# EAGLE design dso_v3b (EAGLE 6.4)
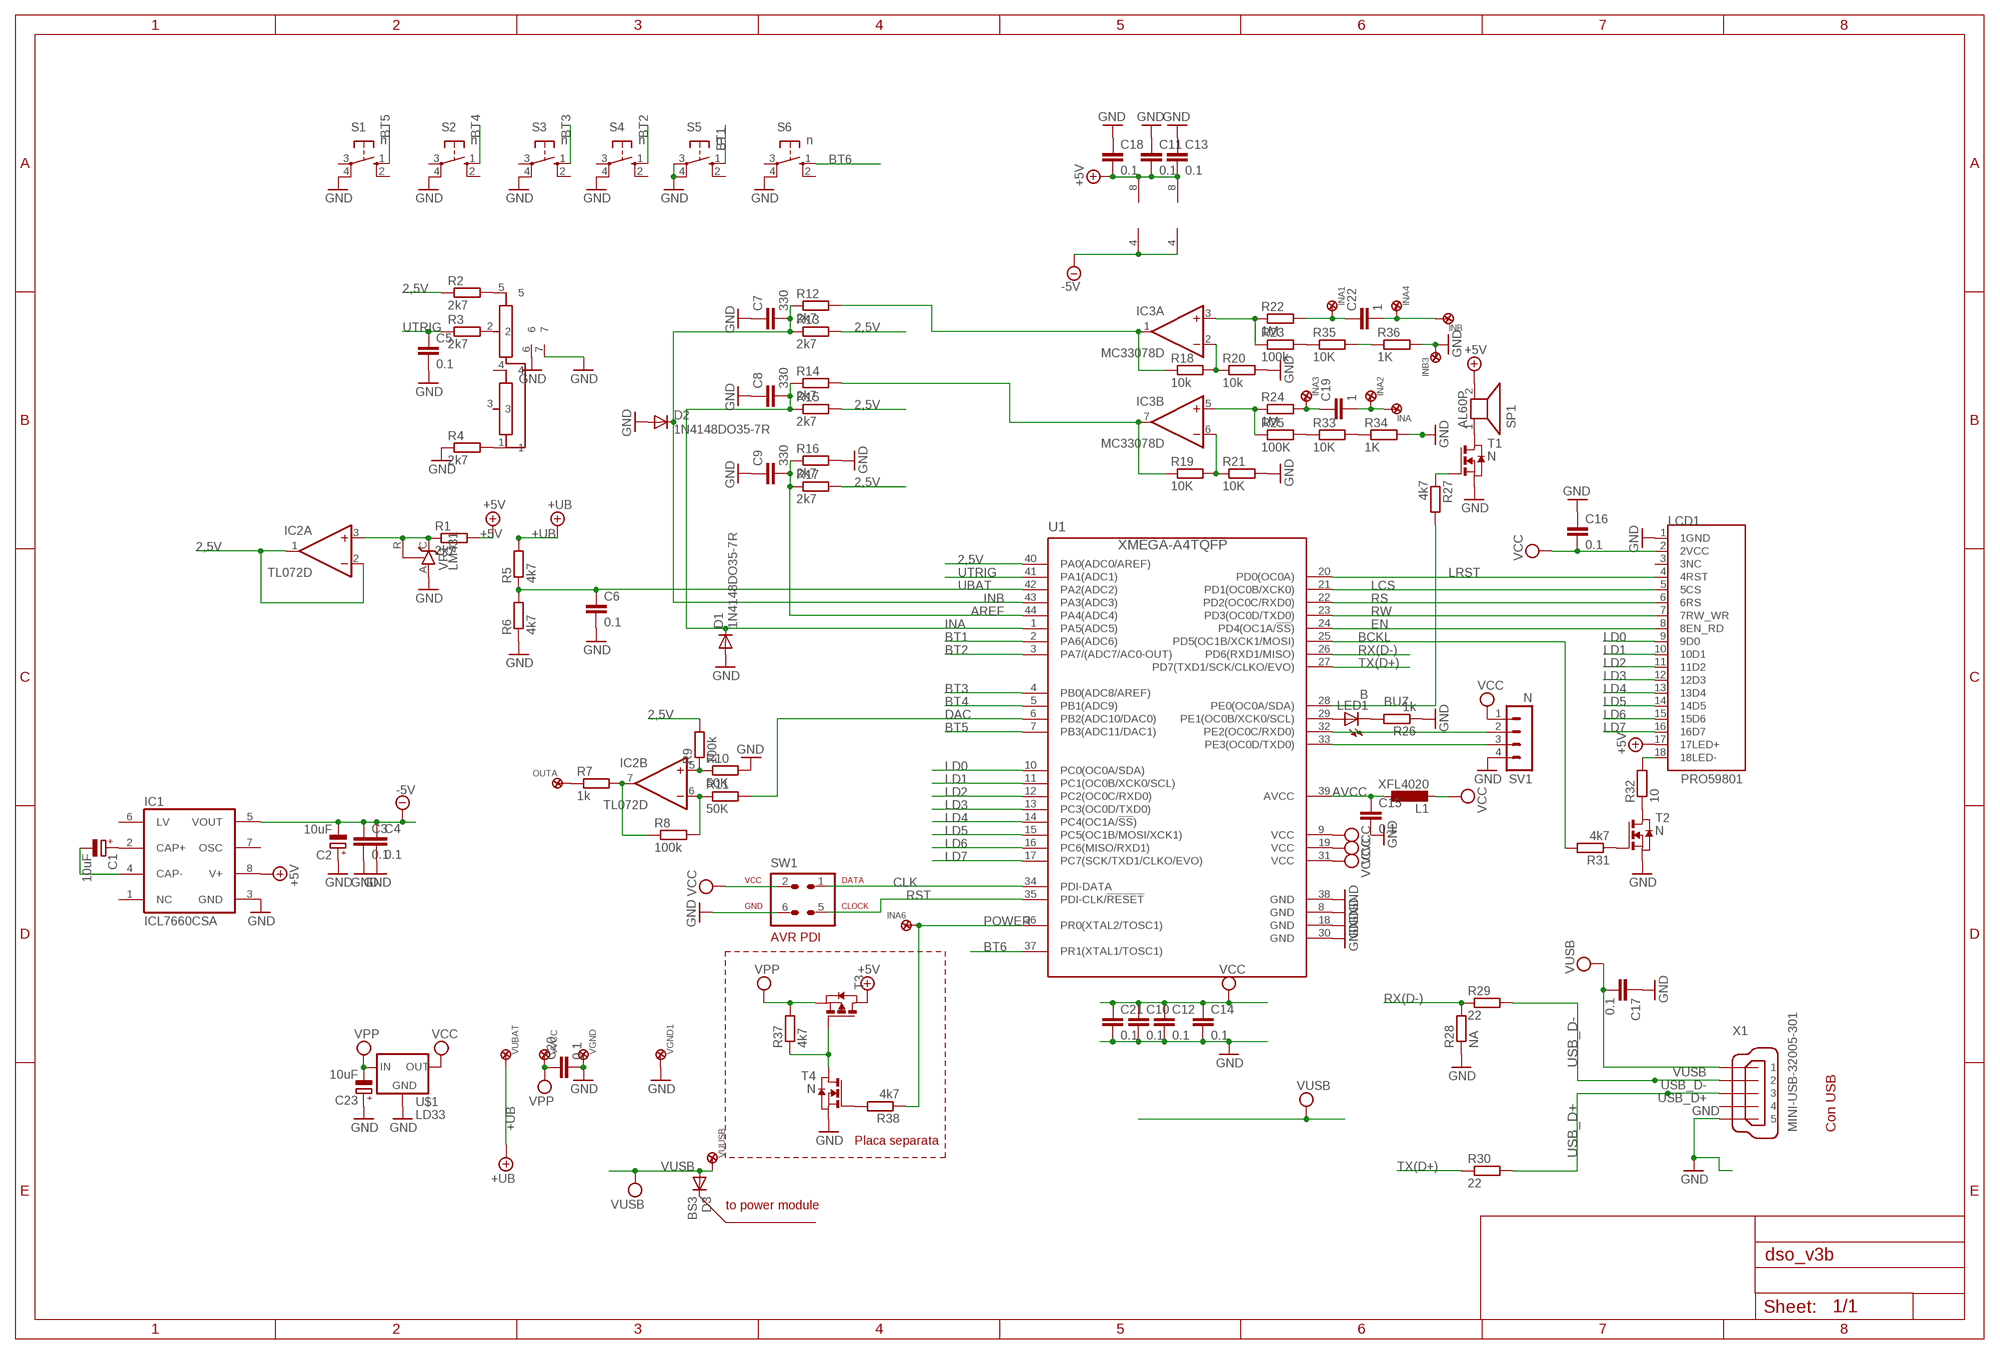
[diagram p0: schematic, sheet 1]

## Parts
C1  10uF  CPOL-EUCT3528  [CT3528]
C2  10uF  CPOL-EUCT3528  [CT3528]
C3  0.1  C-EUC0603  [C0603]
C4  0.1  C-EUC0603  [C0603]
C5  0.1  C-EUC0603  [C0603]
C6  0.1  C-EUC0603  [C0603]
C7  330  C-EU025-024X044  [C025-024X044]
C8  330  C-EU025-024X044  [C025-024X044]
C9  330  C-EU025-024X044  [C025-024X044]
C10  0.1  C-EUC0603  [C0603]
C11  0.1  C-EUC0603  [C0603]
C12  0.1  C-EUC0603  [C0603]
C13  0.1  C-EUSPEC  [SMD_SPECIAL]
C14  0.1  C-EUC0603  [C0603]
C15  0.1  C-EUC0603  [C0603]
C16  0.1  C-EUC0603  [C0603]
C17  0.1  C-EUC1206  [C1206]
C18  0.1  C-EUC0603  [C0603]
C19  1  C-EUC0603  [C0603]
C20  0.1  C-EUC0805  [C0805]
C21  0.1  C-EUC0805  [C0805]
C22  1  C-EUC0603  [C0603]
C23  10uF  CPOL-EUCT3528  [CT3528]
D1  1N4148DO35-7R  [DO35-7R]
D2  1N4148DO35-7R  [DO35-7R]
D3  BS3  1N4148DO35-7R  [DO35-7R]
IC1  ICL7660CSA  [SO08]
IC2  TL072D  [SO08]
IC3  MC33078D  [SO08]
INA  PADR1  [LP1]
INA1  PADR  [LP]
INA2  PADR  [LP]
INA3  PADR  [LP]
INA4  PADR  [LP]
INA6  PADR1  [LP1]
INB  PADR1  [LP1]
INB3  PADR1  [LP1]
L1  XFL4020  [XFL4020]
LCD1  PRO59801  PRO59801L  [PRO59801L]
LED1  B  LED3MM  [LED3MM]
OUTA  PADR1  [LP1]
P1  POT5P  [POT5P]
R1  2k7  R-EU_0204/7  [0204/7]
R2  2k7  R-EU_R0603  [R0603]
R3  2k7  R-EU_R0603  [R0603]
R4  2k7  R-EU_SPEC  [SMD_SPECIAL]
R5  4k7  R-EU_R0603  [R0603]
R6  4k7  R-EU_R0603  [R0603]
R7  1k  R-EU_R0603  [R0603]
R8  100k  R-EU_R0805  [R0805]
R9  100k  R-EU_R0805  [R0805]
R10  50K  R-EU_R0805  [R0805]
R11  50K  R-EU_SPEC  [SMD_SPECIAL]
R12  2k7  R-EU_SPEC  [SMD_SPECIAL]
R13  2k7  R-EU_R0603  [R0603]
R14  2k7  R-EU_SPEC  [SMD_SPECIAL]
R15  2k7  R-EU_R0603  [R0603]
R16  2k7  R-EU_SPEC  [SMD_SPECIAL]
R17  2k7  R-EU_SPEC  [SMD_SPECIAL]
R18  10k  R-EU_R0805  [R0805]
R19  10K  R-EU_R0805  [R0805]
R20  10k  R-EU_R0805  [R0805]
R21  10K  R-EU_R0805  [R0805]
R22  1M  R-EU_R0805  [R0805]
R23  100k  R-EU_R0805  [R0805]
R24  1M  R-EU_R0805  [R0805]
R25  100K  R-EU_R0603  [R0603]
R26  1k  R-EU_R0603  [R0603]
R27  4k7  R-EU_0204/7  [0204/7]
R28  NA  R-EU_R0603  [R0603]
R29  22  R-EU_R0603  [R0603]
R30  22  R-EU_R0603  [R0603]
R31  4k7  R-EU_R0603  [R0603]
R32  10  R-EU_SPEC  [SMD_SPECIAL]
R33  10K  R-EU_R0805  [R0805]
R34  1K  R-EU_R0603  [R0603]
R35  10K  R-EU_R0805  [R0805]
R36  1K  R-EU_R0603  [R0603]
R37  4k7  R-EU_R0603  [R0603]
R38  4k7  R-EU_R0603  [R0603]
S1  n  10-XX  [B3F-10XX]
S2  n  10-XX  [B3F-10XX]
S3  n  10-XX  [B3F-10XX]
S4  n  10-XX  [B3F-10XX]
S5  n  10-XX  [B3F-10XX]
S6  n  10-XX  [B3F-10XX]
SP1  AL60P  [AL60P]
SV1  N  MA04-1R  [MA04-1R]
SW1  AVR-PDIS  [AVR-ISP-6S]
T1  N  NMOSSOT23  [SOT-23]
T2  N  NMOSSOT23  [SOT-23]
T3  PMOSSOT23  [SOT-23]
T4  N  NMOSSOT23  [SOT-23]
U1  XMEGA-A4TQFP  [TQFP44]
U$1  LD33  [SOT223]
VGND  PADR1  [LP1]
VGND1  PADR1  [LP1]
VR1  LM431  TL431CLP  [TO92-CLP]
VUBAT  PADR1  [LP1]
VUUSB  PADR1  [LP1]
VVCC  PADR1  [LP1]
X1  MINI-USB-32005-301  [32005-301]

## Nets
2,5V: IC2.1(A:OUT) IC2.2(A:-IN) R2.1 R9.2 R13.2 R15.2 R17.4 U1.40(PA0(ADC0/AREF))
+5V: C11.2 C13.4 C18.2 IC1.8(V+) IC2.8(P:V+) IC3.8(P:V+) LCD1.17(17LED+) R1.2 SP1.2 T3.1(D)
+UB: R5.2 VUBAT.P$1
-5V: C2.- C3.1 C4.1 IC1.5(VOUT) IC2.4(P:V-) IC3.4(P:V-)
AREF: C9.2 R16.3 R17.3 U1.44(PA4(ADC4))
AVCC: C15.1 L1.P$1 U1.39(AVCC)
BCKL: R31.2 U1.25(PD5(OC1B/XCK1/MOSI))
BT1: S5.1(S) U1.2(PA6(ADC6))
BT2: S4.1(S) U1.3(PA7/(ADC7/AC0-OUT))
BT3: S3.1(S) U1.4(PB0(ADC8/AREF))
BT4: S2.1(S) U1.5(PB1(ADC9))
BT5: S1.1(S) U1.7(PB3(ADC11/DAC1))
BT6: S6.1(S) U1.37(PR1(XTAL1/TOSC1))
BUZ: R27.2 U1.28(PE0(OC0A/SDA))
CLK: SW1.1 U1.34(PDI-DATA)
DAC: R11.4 U1.6(PB2(ADC10/DAC0))
EN: LCD1.8(8EN_RD) U1.24(PD4(OC1A/!SS!))
GND: C2.+ C3.2 C4.2 C5.2 C6.2 C7.1 C8.1 C9.1 C10.2 C11.1 C12.2 C13.3 C14.2 C15.2 C16.1 C17.1 C18.1 C20.2 C21.2 C23.+ D1.A D2.A IC1.3(GND) INB3.P$1 LCD1.1(1GND) P1.6 P1.7 R4.3 R6.1 R10.2 R16.4 R20.2 R21.2 R26.1 R28.1 R34.2 R36.2 S1.4(P1) S2.4(P1) S3.4(P1) S4.4(P1) S5.3(P) S5.4(P1) S6.4(P1) SV1.4 SW1.6 T1.2(S) T2.2(S) T4.2(S) U1.8(GND) U1.18(GND) U1.30(GND) U1.38(GND) U$1.1(GND) VGND1.P$1 VGND.P$1 VR1.A X1.5
INA: C8.2 D1.C R14.3 R15.1 U1.1(PA5(ADC5))
INB: C7.2 D2.C R12.3 R13.1 U1.43(PA3(ADC3))
LCS: LCD1.5(5CS) U1.21(PD1(OC0B/XCK0))
LD0: LCD1.9(9D0) U1.10(PC0(OC0A/SDA))
LD1: LCD1.10(10D1) U1.11(PC1(OC0B/XCK0/SCL))
LD2: LCD1.11(11D2) U1.12(PC2(OC0C/RXD0))
LD3: LCD1.12(12D3) U1.13(PC3(OC0D/TXD0))
LD4: LCD1.13(13D4) U1.14(PC4(OC1A/!SS!))
LD5: LCD1.14(14D5) U1.15(PC5(OC1B/MOSI/XCK1))
LD6: LCD1.15(15D6) U1.16(PC6(MISO/RXD1))
LD7: LCD1.16(16D7) U1.17(PC7(SCK/TXD1/CLKO/EVO))
LRST: LCD1.4(4RST) U1.20(PD0(OC0A))
N$1: C1.+ IC1.2(CAP+)
N$2: C1.- IC1.4(CAP-)
N$3: R37.1 T3.3(G) T4.1(D)
N$4: IC2.3(A:+IN) R1.1 VR1.C VR1.R
N$5: R38.2 T4.3(G)
N$6: LED1.A U1.29(PE1(OC0B/XCK0/SCL))
N$7: SV1.2 U1.32(PE2(OC0C/RXD0))
N$8: SV1.3 U1.33(PE3(OC0D/TXD0))
N$9: R27.1 T1.3(G)
N$10: LCD1.18(18LED-) R32.4
N$11: R32.3 T2.1(D)
N$12: R31.1 T2.3(G)
N$13: R33.2 R34.1
N$14: P1.1 R4.4
N$15: P1.5 R2.2
N$16: IC3.1(A:OUT) R12.4 R18.1
N$17: IC3.7(B:OUT) R14.4 R19.1
N$18: P1.2 R3.2
N$19: IC3.3(A:+IN) R22.1 R23.1
N$20: IC3.2(A:-IN) R18.2 R20.1
N$21: IC3.5(B:+IN) R24.1 R25.1
N$22: IC3.6(B:-IN) R19.2 R21.1
N$23: C22.2 INA4.P$1 INB.P$1
N$24: C19.2 INA2.P$1 INA.P$1
N$25: IC2.5(B:+IN) R9.1 R10.1
N$26: IC2.6(B:-IN) R8.2 R11.3
N$27: IC2.7(B:OUT) R7.2 R8.1
N$28: OUTA.P$1 R7.1
N$30: SP1.1 T1.1(D)
N$31: LED1.K(C) R26.2
N$36: C19.1 INA3.P$1 R24.2
N$37: R25.2 R33.1
N$38: R23.2 R35.1
N$41: R35.2 R36.1
N$42: C22.1 INA1.P$1 R22.2
POWER: INA6.P$1 R38.1 U1.36(PR0(XTAL2/TOSC1))
RS: LCD1.6(6RS) U1.22(PD2(OC0C/RXD0))
RST: SW1.5 U1.35(PDI-CLK/!RESET)
RW: LCD1.7(7RW_WR) U1.23(PD3(OC0D/TXD0))
RX(D-): R28.2 R29.1 U1.26(PD6(RXD1/MISO))
TX(D+): R30.1 U1.27(PD7(TXD1/SCK/CLKO/EVO))
UBAT: C6.1 R5.1 R6.2 U1.42(PA2(ADC2))
USB_D+: R30.2 X1.3
USB_D-: R29.2 X1.2
UTRIG: C5.1 R3.1 U1.41(PA1(ADC1))
VCC: C10.1 C12.1 C14.1 C16.2 C21.1 L1.P$2 LCD1.2(2VCC) SV1.1 SW1.2 U1.9(VCC) U1.19(VCC) U1.31(VCC) U$1.2(OUT) U$1.4(OUT)
VPP: C20.1 C23.- R37.2 T3.2(S) U$1.3(IN) VVCC.P$1
VUSB: C17.2 D3.A VUUSB.P$1 X1.1
Unconnected: D3.C IC1.1(NC) IC1.6(LV) IC1.7(OSC) LCD1.3(3NC) P1.3 P1.4 S1.2(S1) S1.3(P) S2.2(S1) S2.3(P) S3.2(S1) S3.3(P) S4.2(S1) S4.3(P) S5.2(S1) S6.2(S1) S6.3(P) X1.4

## Notes on the sheet
- Con USB
- Placa separata
- to power module

## Library data of the parts
C1 C2 C23 = 000a:CPOL-EU: POLARIZED CAPACITOR, European symbol
C3-C16 C18-C22 = 000a:C-EU: CAPACITOR, European symbol
C17 = rcl:C-EU: CAPACITOR, European symbol
D1-D3 = 000t:1N4148: DIODE high speed (Philips)
IC1 = maxim:ICL7660CSA: VOLTAGE CONVERTER; MF: MAXIM; MPN: ICL7660CSA; OC_FARNELL: 9724710; OC_NEWARK: 34C3732
IC2 = linear:TL072: OP AMP
IC3 = linear:MC33078: OP AMP
INA INA1-INA4 INA6 INB INB3 OUTA VGND VGND1 VUBAT VUUSB VVCC = 0000:PAD
L1 = 000a:XFL4020
LCD1 = 0000:PRO59801
LED1 = 000o:LED: LED OSRAM: - CHIPLED LG R971, LG N971, LY N971, LG Q971, LY Q971, LO R971, LY R971 LH N974, LH R974 LS Q976, LO Q976, LY Q976 LO Q996 - Hyper CHIPLED LW Q18S LB Q993, LB Q99A, LB R99A - SideLED LS A670, LO A670, LY A670, LG A670, LP A670 LB A673, LV A673, LT A673, LW A673 LH A674 LY A675 LS A676, LA A676, LO A676, LY A676, LW A676 LS A679, LY A679, LG A679 - Hyper Micro SIDELED® LS Y876, LA Y876, LO Y876, LY Y876 LT Y87S - SmartLED LW L88C, LW L88S LB L89C, LB L89S, LG L890 LS L89K, LO L89K, LY L89K LS L896, LA L896, LO L896, LY L896 - TOPLED LS T670, LO T670, LY T670, LG T670, LP T670 LSG T670, LSP T670, LSY T670, LOP T670, LYG T670 LG T671, LOG T671, LSG T671 LB T673, LV T673, LT T673, LW T673 LH T674 LS T676, LA T676, LO T676, LY T676, LB T676, LH T676, LSB T676, LW T676 LB T67C, LV T67C, LT T67C, LS T67K, LO T67K, LY T67K, LW E67C LS E67B, LA E67B, LO E67B, LY E67B, LB E67C, LV E67C, LT E67C LW T67C LS T679, LY T679, LG T679 LS T770, LO T770, LY T770, LG T770, LP T770 LB T773, LV T773, LT T773, LW T773 LH T774 LS E675, LA E675, LY E675, LS T675 LS T776, LA T776, LO T776, LY T776, LB T776 LHGB T686 LT T68C, LB T68C - Hyper Mini TOPLED® LB M676 - Mini TOPLED Santana® LG M470 LS M47K, LO M47K, LY M47K Source: http://www.osram.convergy.de LUXEON: - LUMILED® LXK2-PW12-R00, LXK2-PW12-S00, LXK2-PW14-U00, LXK2-PW14-V00 LXK2-PM12-R00, LXK2-PM12-S00, LXK2-PM14-U00 LXK2-PE12-Q00, LXK2-PE12-R00, LXK2-PE12-S00, LXK2-PE14-T00, LXK2-PE14-U00 LXK2-PB12-K00, LXK2-PB12-L00, LXK2-PB12-M00, LXK2-PB14-N00, LXK2-PB14-P00, LXK2-PB14-Q00 LXK2-PR12-L00, LXK2-PR12-M00, LXK2-PR14-Q00, LXK2-PR14-R00 LXK2-PD12-Q00, LXK2-PD12-R00, LXK2-PD12-S00 LXK2-PH12-R00, LXK2-PH12-S00 LXK2-PL12-P00, LXK2-PL12-Q00, LXK2-PL12-R00 Source: www.luxeon.com KINGBRIGHT: KA-3528ASYC Source: www.kingbright.com
P1 = 000a:POT5P
R1-R38 = 000a:R-EU_: RESISTOR, European symbol
S1-S6 = 0000:10-XX: OMRON SWITCH; MPN: B3F-1000; OC_FARNELL: 176432; OC_NEWARK: 36M3542
SP1 = buzzer:AL60P: SPEAKER Source: Buerklin; OC_FARNELL: unknown; OC_NEWARK: unknown
SV1 = 0000:MA04-1: PIN HEADER
SW1 = avr-7:AVR-PDI: AVR PDI programming interface connector
T1 T2 T4 = zetex:NMOSSOT23: MOS FET; OC_FARNELL: unknown; OC_NEWARK: unknown
T3 = zetex:PMOSSOT23: MOS FET; OC_FARNELL: unknown; OC_NEWARK: unknown
U1 = avr-7:XMEGA-A4: Atmel XMega A4 series processor
U$1 = 000t:LD33
VR1 = v-reg:TL431CLP: VOLTAGE REGULATOR
X1 = con-cypressindustries:MINI-USB-: MINI USB-B Conector Source: www.cypressindustries.com; OC_FARNELL: unknown; OC_NEWARK: unknown

## Board
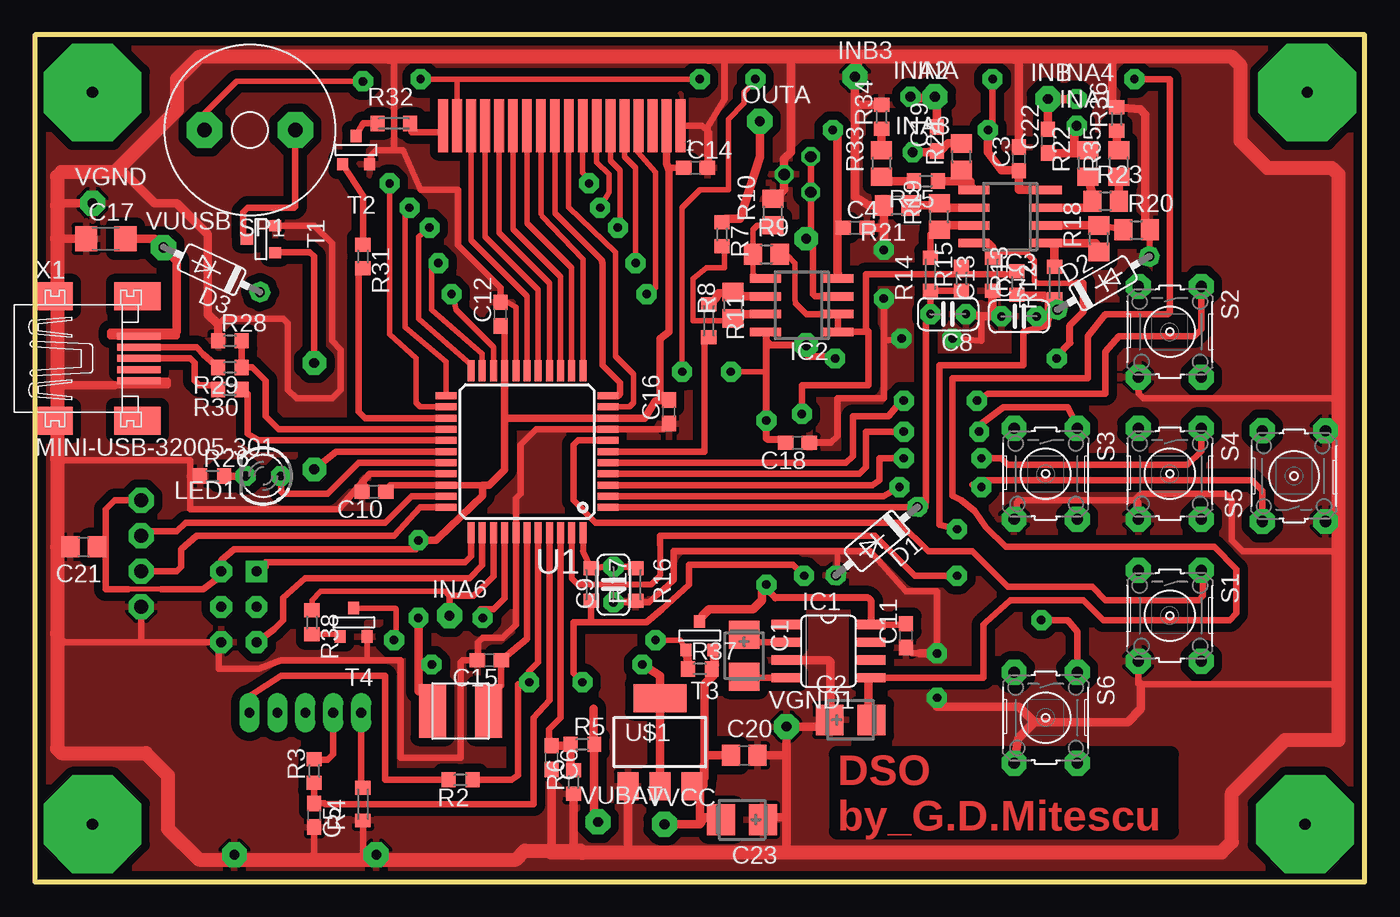
[diagram p1: board, top side]
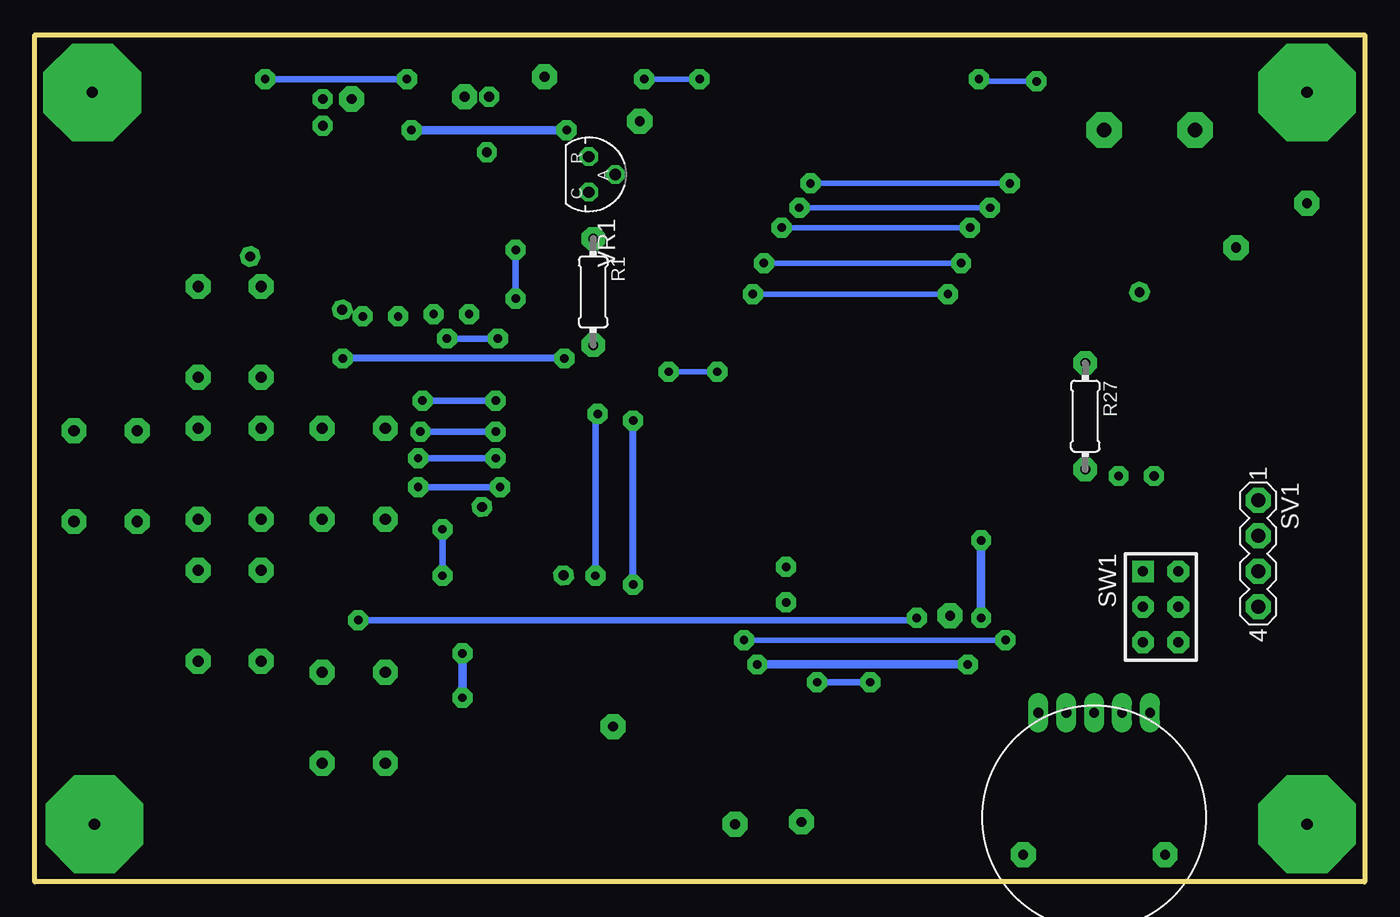
[diagram p2: board, bottom side, seen from below]

Size 95.23 x 60.63 mm. Coordinates in mm from the lower left corner, seen from the top.
Outline: 0,0 95.23,0 95.23,60.63 0,60.63 0,0
Copper layers (1+2+16): Top 0.035mm / dielectric 1.5mm / Route2 0.035mm / dielectric 0.15mm / Bottom 0.035mm
Design rules "default *": minimum track width 10mil, minimum drill 10mil, track to track 8mil, track to pad 8mil, pad to pad 8mil, via to via 8mil, smd to smd 8mil, copper to edge 24mil, drill to drill 8mil, minimum pad ring 10mil, minimum via ring 8mil, stop-mask expansion 4mil, vias tented up to drill 0mil, thermal gap 10mil

### Footprints (pad centres in the part's own frame; a part is rotated, then mirrored left to right if it is on the bottom)
CT3528 = smd 2 x 2.2: + -1.5,0; - 1.5,0
C0603 = smd 1.1 x 1: 1 -0.85,0; 2 0.85,0
C025-024X044 = drill 0.6 pad 1.422 octagon: 1 -1.27,0; 2 1.27,0
SMD_SPECIAL = smd 1 x 1.1: 3 -1.167,0; 4 1.167,0
C1206 = smd 1.6 x 1.8: 1 -1.4,0; 2 1.4,0
C0805 = smd 1.3 x 1.5: 1 -0.95,0; 2 0.95,0
DO35-7R = drill 0.7 pad 1.422 octagon: A 3.81,0; C -3.81,0
SO08 = smd 0.66 x 2.032: 1 -1.905,-3.073; 2 -0.635,-3.073; 3 0.635,-3.073; 4 1.905,-3.073; 5 1.905,3.073; 6 0.635,3.073; 7 -0.635,3.073; 8 -1.905,3.073
SO08' = smd 0.6 x 2.2: 1 -1.905,-2.6; 2 -0.635,-2.6; 3 0.635,-2.6; 4 1.905,-2.6; 5 1.905,2.6; 6 0.635,2.6; 7 -0.635,2.6; 8 -1.905,2.6
LP1 = drill 0.7 pad 1.8 octagon: P$1 0,0
LP = drill 0.7 pad 1.422 octagon: P$1 0,0
XFL4020 = smd 3.81 x 1.93: P$1 0,2; P$2 0,-2
PRO59801L = smd 0.7 x 3.8: 1 -8.77,0; 2 -7.77,0; 3 -6.77,0; 4 -5.77,0; 5 -4.77,0; 6 -3.77,0; 7 -2.77,0; 8 -1.77,0; 9 -0.77,0; 10 0.23,0; 11 1.23,0; 12 2.23,0; 13 3.23,0; 14 4.23,0; 15 5.23,0; 16 6.23,0; 17 7.23,0; 18 8.23,0
LED3MM = drill 0.6 pad 1.422 octagon: A -1.27,0 | drill 0.7 pad 1.422 octagon: K 1.27,0
POT5P = drill 0.7 pad 1.422 long: 1 -4,7.5; 2 -2,7.5; 3 0,7.5; 4 2,7.5; 5 4,7.5 | drill 0.7 pad 1.778 octagon: 6 -5.08,-2.66; 7 5.08,-2.66
0204/7 = drill 0.7 pad 1.676 octagon: 1 -3.81,0; 2 3.81,0
R0603 = smd 1 x 1.1: 1 -0.85,0; 2 0.85,0
R0805 = smd 1.3 x 1.5: 1 -0.95,0; 2 0.95,0
B3F-10XX = drill 0.8 pad 1.778 octagon: 1 -3.251,2.261; 2 3.251,2.261; 3 -3.251,-2.261; 4 3.251,-2.261
AL60P = drill 1.016 pad 2.54 octagon: 1 -3.251,0; 2 3.251,0
MA04-1R = drill 1.016 pad 1.778 octagon: 1 -3.81,0; 2 -1.27,0; 3 1.27,0; 4 3.81,0
AVR-ISP-6S = drill 0.7 pad 1.55 square: 1 -2.54,-1.27 | drill 0.7 pad 1.55 octagon: 2 -2.54,1.27; 3 0,-1.27; 4 0,1.27; 5 2.54,-1.27; 6 2.54,1.27
SOT-23 = smd 0.787 x 0.889: 1 0.025,-1.016; 2 -0.94,1.016; 3 0.991,1.016
TQFP44 = smd 1.5 x 0.5: 1 -5.8,4; 2 -5.8,3.2; 3 -5.8,2.4; 4 -5.8,1.6; 5 -5.8,0.8; 6 -5.8,0; 7 -5.8,-0.8; 8 -5.8,-1.6; 9 -5.8,-2.4; 10 -5.8,-3.2; 11 -5.8,-4; 23 5.8,-4; 24 5.8,-3.2; 25 5.8,-2.4; 26 5.8,-1.6; 27 5.8,-0.8; 28 5.8,0; 29 5.8,0.8; 30 5.8,1.6; 31 5.8,2.4; 32 5.8,3.2; 33 5.8,4 | smd 0.5 x 1.5: 12 -4,-5.8; 13 -3.2,-5.8; 14 -2.4,-5.8; 15 -1.6,-5.8; 16 -0.8,-5.8; 17 0,-5.8; 18 0.8,-5.8; 19 1.6,-5.8; 20 2.4,-5.8; 21 3.2,-5.8; 22 4,-5.8; 34 4,5.8; 35 3.2,5.8; 36 2.4,5.8; 37 1.6,5.8; 38 0.8,5.8; 39 0,5.8; 40 -0.8,5.8; 41 -1.6,5.8; 42 -2.4,5.8; 43 -3.2,5.8; 44 -4,5.8
SOT223 = smd 1.5 x 2: 1 -2.3,-3.15; 2 0,-3.15; 3 2.3,-3.15 | smd 3.8 x 2: 4 0,3.15
TO92-CLP = drill 0.813 octagon: A 0,1.905; C 1.27,0; R -1.27,0
32005-301 = smd 3.1 x 0.5: 1 3,1.6; 2 3,0.8; 3 3,0; 4 3,-0.8; 5 3,-1.6 | smd 2.5 x 2: M1 -3,-4.45; M2 -3,4.45 | smd 3.3 x 2: M3 2.9,4.45; M4 2.9,-4.45

### Placement (x,y rotation side)
C1  50.8,16.19 270 top
C2  58.42,11.59 0 top
C3  70.48,51.75 90 top
C4  58.74,46.83 0 top
C5  20,4.76 270 top
C6  36.99,8.89 270 top
C7  70.48,40.48 0 top
C8  65.41,40.64 180 top
C9  41.43,21.27 90 top
C10  24.29,27.94 180 top
C11  62.39,17.62 90 top
C12  33.34,40.64 90 top
C13  68.58,43.5 90 top
C14  47.31,51.12 0 top
C15  32.54,15.88 180 top
C16  45.4,33.66 90 top
C17  5.08,46.04 0 top
C18  54.61,31.43 180 top
C19  64.61,53.18 90 top
C20  50.8,9.05 0 top
C21  3.49,23.97 180 top
C22  72.55,53.02 90 top
C23  50.64,4.45 180 top
D1  60.29,24.39 220 top
D2  76.52,42.86 30 top
D3  12.67,43.82 155 top
IC1  56.83,16.51 270 top
IC2  TL072D  [SO08']  54.93,41.27 90 top
IC3  MC33078D  [SO08']  69.85,47.62 90 top
INA  64.45,56.2 0 top
INA1  74.61,54.13 0 top
INA2  62.71,56.2 0 top
INA3  62.87,52.23 0 top
INA4  74.61,56.04 0 top
INA6  29.69,19.05 0 top
INB  72.55,56.04 0 top
INB3  58.74,57.63 0 top
L1  30.48,12.22 270 top
LCD1  37.46,54.13 180 top
LED1  16.35,29.05 180 top
OUTA  51.91,54.45 0 top
P1  19.37,4.6 0 bottom
R1  55.24,42.23 270 bottom
R2  30.48,7.3 180 top
R3  20,7.94 90 top
R4  23.49,5.56 90 top
R5  39.21,9.84 0 top
R6  38.58,7.14 90 top
R7  49.21,46.35 270 top
R8  50.01,41.27 90 top
R9  52.39,44.93 0 top
R10  52.86,47.94 90 top
R11  48.26,40.16 270 top
R12  73.03,42.86 90 top
R13  70.33,42.86 90 top
R14  64.14,43.5 90 top
R15  66.36,43.18 90 top
R16  43.02,21.27 270 top
R17  39.85,21.27 270 top
R18  76.2,46.04 90 top
R19  64.77,47.62 90 top
R20  78.9,46.67 0 top
R21  61.75,48.42 180 top
R22  75.41,51.44 90 top
R23  76.68,48.74 0 top
R24  66.36,51.91 90 top
R25  63.82,50.16 180 top
R26  12.7,29.05 0 top
R27  20,33.34 270 bottom
R28  13.97,38.73 0 top
R29  13.97,36.83 180 top
R30  13.97,35.24 180 top
R31  23.49,44.77 270 top
R32  25.72,54.29 0 top
R33  60.64,51.44 90 top
R34  60.64,54.77 90 top
R35  77.63,51.44 90 top
R36  77.47,54.61 90 top
R37  47.62,15.24 0 top
R38  19.84,18.57 270 top
S1  81.28,19.05 270 top
S2  81.28,39.37 270 top
S3  72.39,29.21 270 top
S4  81.28,29.21 270 top
S5  90.17,29.05 90 top
S6  72.39,11.75 270 top
SP1  15.4,53.82 180 top
SV1  7.62,23.5 270 bottom
SW1  14.61,19.68 270 bottom
T1  16.19,46.04 270 top
T2  23.02,52.39 180 top
T3  47.62,17.62 180 top
T4  22.86,18.57 180 top
U1  35.24,30.8 180 top
U$1  44.77,10 0 top
VGND  4.13,48.58 0 top
VGND1  53.82,11.11 0 top
VR1  55.56,50.64 270 bottom
VUBAT  40.32,4.29 0 top
VUUSB  9.21,45.4 0 top
VVCC  45.09,4.13 0 top
X1  4.45,37.47 0 top

### Tracks (layer width: path | path; a pad name or v marks a point on that pad's centre or on a via)
2,5V  (via drill 0.6 pad 1.42)
  Top 0.406: R9.2 53.82,44.93 54.45,44.29 54.45,41.64 54.51,41.38
  Top 0.45: R13.2 70.38,43.71 70.17,43.5 66.36,43.5 | R15.2 66.46,44.13 66.46,43.6 66.36,43.5 | U1.40 36.04,15.72 35.72,15.4 35.41,15.07 v35.41,14.29 | v35.41,14.29 v35.4,14.29 | v35.41,14.29 34.61,14.13 34.61,7.63 34.13,7.3 R2.1 | IC2.1 IC2.2 55.24,40.64 54.51,41.38 | IC2.1 59.53,39.37 59.53,43.5 66.36,43.5 | R17.4 39.85,18.57 | 39.85,18.57 43.81,18.57 44.93,19.53 46.83,21.27 46.83,22.7 54.29,22.7 v55.09,21.91 | v54.93,33.5 54.93,35.56 59.69,35.56 59.69,39.43 IC2.1 | 39.85,18.57 38.58,18.57 38.58,14.92 v39.21,14.29
  Bottom 0.45: v39.21,14.29 v35.4,14.29 | v55.09,21.91 55.09,33.34 v54.93,33.5
+5V  (via drill 0.6 pad 1.42)
  Top 0.406: 74.61,42.86 71.76,42.86 71.6,43.02 71.6,44.45 70.96,45.09 68.74,45.09 68.58,45.24 | SP1.2 12.15,55.01 14.45,57.31 v23.49,57.31 | v27.62,57.47 30.32,57.47 | 30.32,57.47 v47.63,57.47 | v51.59,57.47 51.59,57.31 50.8,56.52 50.8,55.72 49.69,54.61 49.69,49.53 47.63,49.53 46.35,48.26 v46.35,36.51 | LCD1.17 30.24,57.38 30.32,57.47 | v49.85,36.51 52.39,36.51
  Top 0.45: IC1.8 62.33,18.41 C11.2
  Top 0.5: IC1.8 59.91,20.1 59.69,20.32 53.02,20.32 52.39,20.95 v52.39,21.27 | 52.39,38.73 52.39,36.51 v52.39,33.02 52.39,31.75 52.49,31.65 53.76,31.65 C18.2 | 52.39,38.73 52.39,39.31 IC2.8 | v57.31,37.47 57.15,37.62 55.4,37.62 55.24,37.78 R1.2 52.7,38.42 52.39,38.73 | v73.18,37.47 73.18,37.62 74.14,38.58 74.14,39.85 75.09,40.8 75.09,42.86 74.61,42.86
  Top 0.61: IC3.8 68.26,45.72 68.58,45.4 68.58,45.24 C13.4 | v52.39,21.27 52.07,20.95 52.07,20.16 51.43,19.53 48.26,19.53 47.76,19.02 T3.1
  Bottom 0.406: v23.49,57.31 27.46,57.31 v27.62,57.47 | v47.63,57.47 v51.59,57.47 | v46.35,36.51 v49.85,36.51
  Bottom 0.5: v52.39,21.27 v52.39,33.02 | v57.31,37.47 v73.18,37.47
+UB
  Top 0.61: VUBAT.P$1 40.06,4.39 R5.2 40,9.74 40,12.38
-5V  (via drill 0.6 pad 1.42)
  Top 0.45: 59.69,14.39 IC1.5 67.95,14.61 67.95,18.41 68.1,18.57 69.85,20.16 75.09,20.16 76.52,18.73 85.57,18.73 86.04,19.21 86.04,22.38 84.46,23.97 69.53,23.97 68.1,25.4 67.31,26.51 66.36,27.3 65.72,27.62 65.72,36.04 75.41,36.04 75.41,39.05 76.68,40.64 81.12,40.64 81.28,40.8 81.28,57.47 v78.74,57.47 | v68.58,57.47 68.58,54.13 v68.26,53.82
  Top 0.61: IC3.4 70.48,49.53 C3.1 70.43,50.96 69.21,50.96 68.26,52.23 v68.26,53.82 | IC2.4 57.53,43.56 57.47,43.66 57.47,46.83 | 57.47,46.83 57.47,53.98 v57.15,53.82 | C4.1 57.47,46.83 | 59.69,14.39 59.69,11.82 C2.-
  Bottom 0.45: v78.74,57.47 v68.58,57.47
  Bottom 0.61: v57.15,53.82 v68.26,53.82
AREF
  Top 0.44: U1.44 39.24,23.68 R17.3
  Top 0.45: 40.27,22.54 R17.3 41.22,22.6 C9.2 43.24,22.54 R16.3
AVCC
  Top 0.45: U1.39 35.24,17.41 C15.1 33.39,14.03 32.7,13.34 32.7,12.45 L1.P$1
BCKL
  Top 0.45: U1.25 23.63,33.2 23.18,33.66 23.18,43.6 R31.2
BT1  (via drill 0.6 pad 1.42)
  Top 0.45: S5.1 87.91,27.98 87.15,28.73 68.1,28.73 | 68.1,28.73 67.15,28.42 v67.79,28.26 68.1,28.73 | U1.2 60.78,27.6 v61.91,28.26
  Bottom 0.45: v61.91,28.26 v67.79,28.26
BT2  (via drill 0.6 pad 1.42)
  Top 0.45: S4.1 83.54,30.84 82.55,29.84 69.69,29.84 69.21,30.32 v67.79,30.32 | U1.3 59.99,28.4 60.48,28.73 60.48,30.32 v62.23,30.32
  Bottom 0.45: v62.23,30.32 v67.79,30.32
BT3  (via drill 0.6 pad 1.42)
  Top 0.45: U1.4 59.04,29.2 59.53,29.69 59.53,32.23 v62.23,32.23 | v67.63,32.23 67.63,32.7 69.37,33.97 73.98,33.97 74.45,33.02 74.45,32.66 S3.1
  Bottom 0.45: v62.23,32.23 v67.63,32.23
BT4  (via drill 0.6 pad 1.42)
  Top 0.45: S2.1 83.54,39.57 83.03,39.05 77.63,39.05 76.68,37.94 76.68,34.92 68.26,34.92 v67.47,34.45 | U1.5 58.1,30 58.58,30.48 58.58,33.34 61.12,33.34 62.07,34.45 v62.23,34.45
  Bottom 0.45: v62.23,34.45 v67.47,34.45
BT5
  Top 0.45: U1.7 38.9,31.6 38.58,31.27 38.58,27.3 40.16,25.72 61.91,25.72 63.98,23.65 67.15,23.65 69.69,21.11 75.72,21.11 76.68,20.16 83.34,20.16 83.66,20.48 83.66,22.18 S1.1
BT6  (via drill 0.6 pad 1.42)
  Top 0.45: U1.37 33.64,20.31 32.86,19.53 31.91,19.53 31.91,18.73 | S6.1 74.65,17.9 73.98,18.73 v72.07,18.73 | v32.07,18.89 31.91,18.73 | 31.91,18.57 31.91,18.73
  Bottom 0.45: v72.07,18.73 32.23,18.73 v32.07,18.89
BUZ
  Top 0.45: U1.28 21.59,30.8 R27.2
CLK
  Top 0.45: U1.34 31.24,23.3 30.8,22.86 16.51,22.86 16.51,22.54 SW1.1
DAC
  Top 0.45: U1.6 47.94,30.8 47.94,38.89 R11.4
EN  (via drill 0.6 pad 1.42)
  Top 0.406: U1.24 27.6,34 27.31,34.29 27.31,37.47 25.4,39.21 v25.4,50.01 | LCD1.8 39.24,50.78 39.69,50.32 v39.69,50.01
  Bottom 0.406: v25.4,50.01 v39.69,50.01
GND  (via drill 0.6 pad 1.42)
  Top 0.406: U1.18 34.44,41.12 33.66,41.59 33.44,41.59 | D1.A 57.47,21.94 57.47,23.65 | D2.A 79.85,44.77 R20.2 | T4.2 23.8,15.89 24.45,15.88
  Top 0.45: U1.30 23.98,29.2 23.34,28.42 | 23.34,28.42 23.65,28.36 C10.2 | 7.62,17.14 SW1.6 13.18,16.99 13.18,15.24 16.03,15.24 17.62,15.88 24.45,15.88 26.19,15.88 26.19,8.89 30.48,8.89 30.48,15.72 30.64,15.88 C15.2 | 7.62,17.14 2.06,17.14 1.59,17.78 | SV1.4 7.62,17.14 | X1.5 9.51,35.87 9.53,35.88 9.53,35.56 5.72,35.56 | T2.2 24.12,52.06 24.45,52.39 25.72,52.39 | 25.72,52.39 25.72,58.74 25.4,59.05 | T1.2 20.02,46.98 21.27,45.72 21.27,38.73 21.91,38.1 21.91,35.24 21.27,34.61 18.73,34.61 18.1,35.24 18.1,40.01 17.78,40.32 13.54,40.32 13.12,39.9 | LCD1.1 47.78,54.13 48.26,53.66 48.26,51.54 C14.2 48.16,54.03 49.37,56.04 49.37,58.9 48.16,58.95 48.26,59.05 | 25.72,52.39 26.35,52.39 27.62,49.53 30.32,49.53 30.32,45.56 33.34,42.55 C12.2 33.44,41.59 | 31.91,15.98 C15.2 | 23.34,28.42 23.97,29.21 21.75,26.67 11.11,26.67 11.11,29.05 11.11,30.16 1.75,30.16 1.59,30.32 | C16.1 45.02,32.4 U1.8 35.89,32.4 34.77,31.27 34.77,27.78 34.44,27.46 U1.38 34.44,18.41 33.5,17.46 32.07,17.46 31.75,17.14 31.75,15.93 C15.2 | 56.43,2.35 56.67,2.1 | R16.4 43.24,20 C9.1 43.97,20 45.72,21.59 45.72,23.65 57.47,23.65 59.85,23.65 62.39,20.8 64.61,20.8 v64.61,16.35 | S2.4 79.02,35.28 79.06,34.92 79.37,34.61 93.19,34.61 93.34,34.45 | S5.4 93.1,32.3 93.34,32.54 | S5.3 93.27,25.8 93.34,25.88 | S4.4 79.02,27.18 78.9,27.3 | 78.9,27.3 70.48,27.3 70.33,27.15 70.33,26.16 S3.4 | 78.9,27.3 78.9,27.46 79.22,27.78 85.25,27.78 85.73,27.3 85.73,24.45 86.52,23.65 93.34,23.65 | S1.4 79.02,14.17 79.06,14.13 79.22,14.13 93.19,14.13 93.34,13.97 | v60.8,41.75 60.8,38.73 | 60.8,38.73 60.8,34.61 57.47,34.61 57.47,31.91 56.99,31.43
  Top 0.45: 67.79,40.48 67.79,38.73 v65.72,38.89 | v62.07,38.89 60.8,38.73 | C5.2 20,1.75 19.84,1.59 | R4.3 23.49,1.75 23.34,1.59 | C21.2 1.59,23.97 | 63.4,16.35 62.81,16.35 C11.1
  Top 0.5: 56.99,31.43 C18.1
  Top 0.55: R26.1 11.11,29.05
  Top 0.61: INB3.P$1 58.74,55.62 | 58.74,55.62 58.74,49.05 59.69,48.42 R21.2 | C3.2 70.48,58.74 70.17,59.05 | 76.84,59.05 77.15,58.74 77.15,55.62 R36.2 79.16,55.3 79.53,54.93 79.53,47.25 R20.2 | C13.3 68.58,40.48 | 68.58,40.48 C7.1 | C8.1 67.79,40.48 68.58,40.48 | C6.2 36.99,2.1 | R28.1 13.12,39.9 12.38,40.64 12.38,46.35 10.16,48.58 8.57,48.58 6.03,51.12 | C17.1 1.59,46.04 | 5.72,35.56 1.91,35.56 1.59,35.24 | R10.2 53.08,48.79 53.66,49.53 VR1.A 53.66,51.75 54.13,52.23 54.13,58.9 54.29,59.05 | 60.8,48.48 R21.2 | R21.2 60.74,48.36 60.8,47.62 60.8,46.83 | 60.8,46.83 v60.8,45.24 | C4.2 60.8,46.83 | R34.2 58.74,55.62 | IC1.3 56.83,15.88 56.99,15.72 56.99,11.11 56.83,11.11 | 56.83,11.11 VGND1.P$1 53.82,9.05 | VGND.P$1 1.75,48.58 1.59,48.42 | C2.+ 56.92,11.2 56.83,11.11 | S6.4 70.45,10.28 71.6,11.43 | 71.6,11.43 78.26,11.43 79.22,12.38 79.22,14.13 | R6.1 38.58,2.1 | 53.82,9.05 53.82,4.6 | 53.82,4.6 53.82,2.1 | C20.2 53.82,9.05 | U$1.1 42.47,2.34 42.7,2.1 | 63.4,16.35 v64.61,16.35 | v64.61,13.18 64.61,12.54 70.48,12.54 71.6,11.43 | C23.+ 51.91,4.6 53.82,4.6
  Top 0.813: INB3.P$1 58.9,59.05
  Top 1.016: 36.99,2.1 38.58,2.1 42.7,2.1 53.82,2.1 56.67,2.1 84.97,2.1 85.73,2.86 85.73,6.35 89.54,10.16 93.34,10.16 93.34,13.97 93.34,23.65 93.34,25.88 93.34,32.54 93.34,34.45 93.34,50.64 92.87,51.12 88.26,51.12 86.36,53.02 86.36,58.42 85.73,59.05 76.84,59.05 70.17,59.05 58.9,59.05 54.29,59.05 48.26,59.05 25.4,59.05 11.75,59.05 10.16,57.47 10.16,55.24 6.03,51.12 5.72,50.8 1.91,50.8 1.59,50.48 1.59,48.42 1.59,46.04 1.59,35.24 1.59,30.32 1.59,23.97 1.59,17.78 1.59,9.53 1.91,9.21 7.94,9.21 9.53,7.62 9.53,3.81 11.75,1.59 14.45,1.59 | 14.45,1.59 19.84,1.59 23.34,1.59 24.45,1.59 | 24.45,1.59 34.45,1.59 35.08,2.22 39.05,2.22 39.21,2.06 | P1.6 24.45,1.59 | P1.7 14.29,1.75 14.45,1.59
  Bottom 0.45: v60.8,45.24 v60.8,41.75 | v65.72,38.89 v62.07,38.89
  Bottom 0.61: v64.61,16.35 v64.61,13.18
  pour Top (isolate 0.61): -0.32,61.12 95.57,60.64 95.57,0 -0.32,0.32
INA
  Top 0.406: D1.C 63.5,26.84 63.5,26.8
  Top 0.45: R15.1 R14.3 C8.2 63.82,40.01 63.82,27.3 63.79,26.8 63.5,26.8 U1.1
INB  (via drill 0.6 pad 1.42)
  Top 0.406: D2.C 72.75,40.96
  Top 0.44: 44.77,24.13 44.77,21.91 44.13,21.27 38.89,21.27 38.44,21.72 U1.43
  Top 0.45: R13.1 72.29,42.01 72.55,41.75 72.55,39.85 70.8,39.37 70.8,36.99 64.77,36.99 64.77,25.56 v66.04,25.24 | v66.04,21.91 63.02,21.91 60.17,24.77 44.77,24.77 44.77,24.13
  Top 0.61: C7.2 72.39,40.01 72.75,40.96 R12.3 R13.1
  Bottom 0.45: v66.04,25.24 v66.04,21.91
LCS  (via drill 0.6 pad 1.42)
  Top 0.406: U1.21 32.04,37.81 28.42,40.96 28.42,44.13 v28.89,44.29 | LCD1.5 42.24,51.9 43.02,51.12 v43.02,44.29
  Bottom 0.406: v28.89,44.29 v43.02,44.29
LD0
  Top 0.406: U1.10 42.57,34 42.86,34.29 42.86,36.35 41.59,37.62 41.59,45.09 38.24,48.28 LCD1.9
LD1
  Top 0.406: 40.57,44.52 37.24,47.85 LCD1.10
  Top 0.45: U1.11 41.78,34.8 41.91,34.92 41.91,35.72 40.64,36.99 40.64,44.29 40.57,44.52
LD2
  Top 0.406: U1.12 39.24,44.58 36.35,47.62 36.24,47.82 LCD1.11
LD3
  Top 0.406: U1.13 38.44,43.95 35.24,47.15 35.24,47.63 LCD1.12
LD4
  Top 0.406: U1.14 37.64,43.32 34.24,46.73 LCD1.13
LD5
  Top 0.406: U1.15 36.84,42.85 33.24,46.46 LCD1.14
LD6
  Top 0.406: U1.16 36.04,42.38 32.24,46.19 LCD1.15
LD7
  Top 0.406: U1.17 35.24,41.91 31.24,45.92 LCD1.16
LRST  (via drill 0.6 pad 1.42)
  Top 0.406: U1.20 32.84,38.28 30.16,40.96 30,41.59 v29.85,42.07 | LCD1.4 43.18,54.29 43.18,52.23 44.45,50.8 44.45,42.55 v43.81,42.07
  Bottom 0.406: v29.85,42.07 v43.81,42.07
N$1
  Top 0.45: IC1.2 51.75,17.14 51.43,17.46 50.39,17.46 C1.+
N$2
  Top 0.45: IC1.4 50.25,14.61 C1.-
N$3  (via drill 0.6 pad 1.42)
  Top 0.406: T4.1 25.81,19.59 25.88,19.53 25.88,17.46 v25.72,17.3 | v44.45,17.3 46.25,17.3 T3.3
  Top 0.61: T3.3 46.79,15.54 R37.1
  Bottom 0.406: v25.72,17.3 v44.45,17.3
N$4
  Top 0.45: IC2.3 55.88,41.91 55.72,42.07 55.72,46.04 55.56,46.51 VR1.C VR1.R
  Top 0.61: R1.1 55.72,46.04
N$5
  Top 0.406: R38.2 21.86,17.72 T4.3
N$6
  Top 0.45: U1.29 23.17,30 20.95,27.78 17.78,27.78 17.62,27.94 LED1.A
N$7
  Top 0.45: U1.32 26.96,27.6 25.08,25.72 10.79,25.72 10.16,25.08 7.94,25.08 SV1.2
N$8
  Top 0.45: U1.33 27.59,26.8 25.72,24.77 11.59,24.77 10.48,23.81 10.48,22.54 10.16,22.23 SV1.3
N$9
  Top 0.45: R27.1 20,44.77 19.69,45.09 17.25,45.09 T1.3
N$10
  Top 0.45: LCD1.18 29.24,53.68 28.89,53.66 26.99,53.66 26.99,54.19 R32.4
N$11
  Top 0.45: R32.3 23.49,54.29 23.18,53.75 T2.1
N$12
  Top 0.45: R31.1 23.49,49.11 T2.3
N$13
  Top 0.61: R33.2 R34.1
N$14
  Top 0.45: P1.1 23.37,7.01 R4.4
N$15
  Top 0.45: R2.2 25.08,7.3 25.08,14.76 17.62,14.76 15.4,13.34 15.24,12.23 P1.5
N$16
  Top 0.61: R18.1 75.98,45.72 IC3.1 73.03,45.66 R12.4
N$17
  Top 0.45: R19.1 64.24,46.46 64.13,46.35 R14.4
  Top 0.61: IC3.7 64.67,46.99 R19.1
N$18
  Top 0.45: P1.2 21.37,9.14 20.95,8.73 20.06,8.73 R3.2
N$19
  Top 0.61: IC3.3 75.51,48.26 R23.1 75.88,48.63 R22.1
N$20
  Top 0.45: R20.1 76.3,46.99 R18.2
  Top 0.61: IC3.2 75.98,46.99 R18.2
N$21
  Top 0.61: R25.1 66.2,50.16 | 66.2,50.16 66.36,50.16 | 66.36,50.16 66.99,50.16 66.99,49.79 IC3.5 | R24.1 66.36,50.16 | 66.36,50.32 66.2,50.16
N$22
  Top 0.61: 64.67,48.26 R19.2 | IC3.6 64.87,48.26 R19.2 | R21.1 64.56,48.42 R19.2
N$23
  Top 0.61: INA4.P$1 INB.P$1 C22.2
N$24
  Top 0.61: 62.97,56.09 INA.P$1 | INA2.P$1 63.02,56.04 INA.P$1 | C19.2 64.61,55.72 INA.P$1
N$25
  Top 0.406: R10.1 51.75,46.99 51.43,46.67 R9.1 51.44,43.49 51.75,43.18
  Top 0.61: IC2.5 51.75,43.18
N$26
  Top 0.61: IC2.6 50.86,41.91 R8.2 48.95,42.12 48.74,41.75 R11.3
N$27
  Top 0.406: 49.85,40.16 47.15,40.16 47.15,43.18 48.1,43.97 49.37,43.97 49.37,45.35
  Top 0.45: R8.1 50.11,40.42 49.85,40.16 | 49.37,45.35 R7.2
  Top 0.61: IC2.7 50.54,40.64 R8.1
N$28
  Top 0.61: OUTA.P$1 51.91,51.91 50.48,47.47 49.47,47.47 R7.1
N$30
  Top 0.45: SP1.1 18.65,48.34 18.57,48.26 15.24,48.26 14.92,47.94 14.92,46.27 T1.1
N$31
  Top 0.55: R26.2 LED1.K
N$32  (via drill 0.8 pad 7)
  other vias: 4.13,4.13
N$33  (via drill 0.8 pad 7)
  other vias: 4.13,56.52
N$34  (via drill 0.8 pad 7)
  other vias: 91.12,56.52
N$35  (via drill 0.8 pad 7)
  other vias: 90.96,4.13
N$36
  Top 0.61: INA3.P$1 63.66,52.23 | 63.66,52.23 64.4,52.23 64.93,52.39 65.4,52.86 R24.2 | C19.1 63.66,52.23
N$37
  Top 0.61: R25.2 60.64,50.16 R33.1
N$38
  Top 0.61: R35.1 77.63,48.68 R23.2
N$41
  Top 0.61: R36.1 77.47,52.28 R35.2
N$42
  Top 0.61: C22.1 74.45,52.17 | 74.45,52.17 75.88,52.17 R22.2 | INA1.P$1 74.45,53.34 74.45,52.17
POWER
  Top 0.406: 29.69,20.48 29.37,20.8 20.48,20.8 19.84,20.16 R38.1
  Top 0.45: U1.36 32.84,21.89 31.43,20.48 29.69,20.48 INA6.P$1
RS  (via drill 0.6 pad 1.42)
  Top 0.406: U1.22 31.24,37.02 27.46,40.32 27.46,46.2 v28.26,46.83 | LCD1.6 41.24,51.63 41.91,50.96 41.91,47.15 v41.75,46.83
  Bottom 0.406: v28.26,46.83 v41.75,46.83
RST
  Top 0.45: U1.35 32.04,22.68 31.11,21.75 19.37,21.75 17.78,20.32 17.78,18.73 17.14,18.1 SW1.5
RW  (via drill 0.6 pad 1.42)
  Top 0.406: U1.23 29.44,37.23 26.51,39.69 26.51,48.1 v26.83,48.26 | LCD1.7 40.24,51.52 41.12,50.64 41.12,49.37 v40.48,48.26
  Bottom 0.406: v26.83,48.26 v40.48,48.26
RX(D-)
  Top 0.45: R28.2 R29.1 15.56,36.83 16.51,35.88 16.51,33.34 17.45,32.4 U1.26
TX(D+)
  Top 0.45: R30.1 14.92,35.24 15.24,34.92 15.24,32.07 16.03,31.6 U1.27
UBAT
  Top 0.45: U1.42 37.64,11.73 36.81,10.94 36.83,10.64 36.83,10.32 C6.1
  Top 0.61: C6.1 38.26,9.74 R5.1 38.36,8.1 R6.2
USB_D+
  Top 0.45: X1.3 11.11,37.47 11.43,37.15 11.43,35.88 11.75,35.56 12.8,35.56 R30.2
USB_D-
  Top 0.45: X1.2 11.58,38.27 12.06,37.78 R29.2
UTRIG
  Top 0.45: U1.41 36.84,13.01 35.72,11.75 35.72,5.56 20.8,5.56 20.74,5.61 C5.1 R3.1
VCC  (via drill 0.6 pad 1.42)
  Top 0.35: 9.05,20.95 6.67,20.95
  Top 0.45: C10.1 25.44,28.4 U1.31 32.07,28.4 | 9.05,20.95 12.06,20.95 13.34,21.91 SW1.2 13.34,23.02 14.29,23.81 27.31,23.81 v27.46,24.45 | 6.67,20.95 5.08,20.95 5.08,23.97 | 5.08,23.97 5.08,26.67 5.72,27.3 SV1.1 | 45.24,51.44 45.4,51.12 C14.1 | U1.19 33.64,39.48 C12.1 | 33.78,33.2 33.64,33.34 | 28.1,13.4 L1.P$2 | v27.46,18.89 27.31,18.73 | 45.35,34.45 C16.2 44.77,34.82 | C21.1 5.08,23.97
  Top 0.55: LCD1.2 45.24,51.44 45.4,50.96 45.4,39.37 44.77,38.89 44.77,34.82 | U1.19 33.64,33.34 33.64,29.52 32.53,28.4 32.07,28.4 32.07,27.62 28.89,24.61 28.73,24.45 v27.46,24.45 | 33.78,33.2 U1.9 43.67,33.2 44.45,34.45 45.35,34.45 | 27.31,18.73 27.46,18.73
  Top 0.61: 27.46,18.73 27.46,15.56 | 27.46,15.56 27.46,13.65 28.1,13.4 | U$1.2 U$1.4 44.77,14.76 v43.5,15.56 | v28.42,15.56 27.46,15.56
  Bottom 0.61: v27.46,24.45 v27.46,18.89 | v43.5,15.56 v28.42,15.56
VPP
  Top 0.61: VVCC.P$1 47.63,4.13 | 47.63,4.13 47.63,6.83 | 47.63,6.83 47.63,6.93 47.89,6.93 47.94,9.05 | 47.7,7.22 47.94,7.46 47.94,9.05 | 47.94,9.05 47.94,14.13 48.63,14.82 R37.2 48.72,15.49 T3.2 | 47.94,9.05 C20.1 50.01,9.05 | 47.63,4.13 47.94,4.6 48.98,4.6 C23.- | U$1.3 47.6,6.85 47.63,6.83
VUSB
  Top 0.406: D3.A VUUSB.P$1
  Top 0.45: X1.1 5.41,39.06 5.4,39.05 5.4,39.37 | 5.4,39.37 5.72,39.05 10.16,39.05 10.16,39.37 5.4,39.37
  Top 0.5: 8.57,46.04 VUUSB.P$1
  Top 0.61: 10.16,39.37 10.16,44.45 VUUSB.P$1 | C17.2 8.57,46.04

### Text on the board
Top: DSO / by_G.D.Mitescu
Document: GLCD